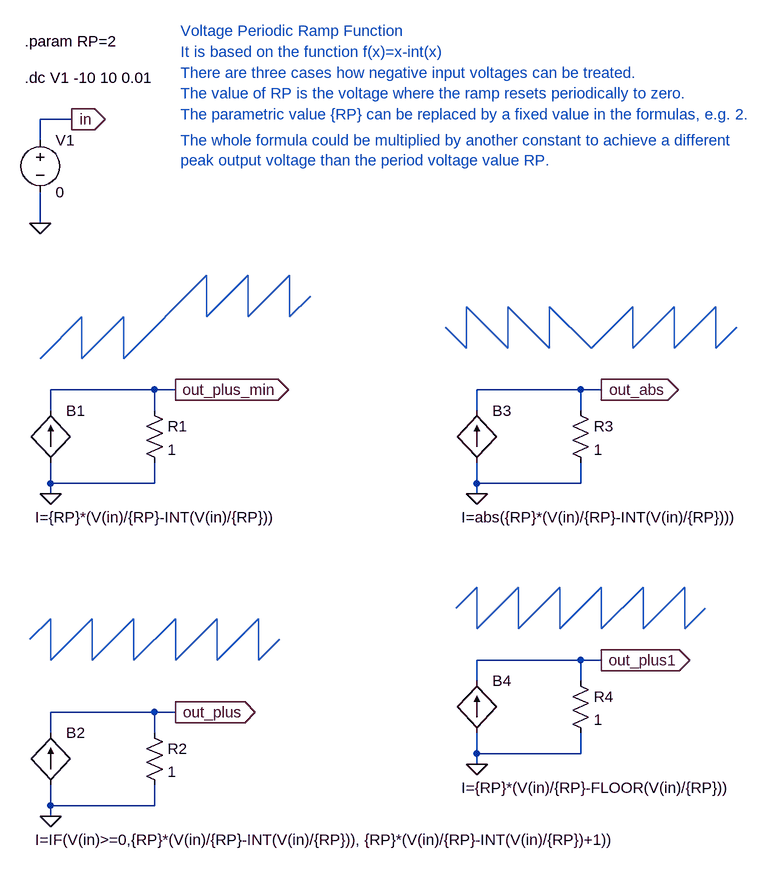
[diagram p0: schematic voltage_periodic_ramp1.asc]
voltage_periodic_ramp1.asc, the LTspice schematic file:
Version 4
SHEET 1 1676 1092
WIRE 16 0 16 -32
WIRE 16 128 16 80
WIRE 32 416 32 384
WIRE 32 528 32 496
WIRE 32 544 32 528
WIRE 32 912 32 880
WIRE 32 1024 32 992
WIRE 32 1040 32 1024
WIRE 64 -32 16 -32
WIRE 192 384 32 384
WIRE 192 416 192 384
WIRE 192 528 32 528
WIRE 192 528 192 496
WIRE 192 880 32 880
WIRE 192 912 192 880
WIRE 192 1024 32 1024
WIRE 192 1024 192 992
WIRE 224 384 192 384
WIRE 224 880 192 880
WIRE 688 416 688 384
WIRE 688 528 688 496
WIRE 688 544 688 528
WIRE 688 832 688 800
WIRE 688 944 688 912
WIRE 688 960 688 944
WIRE 848 384 688 384
WIRE 848 416 848 384
WIRE 848 528 688 528
WIRE 848 528 848 496
WIRE 848 800 688 800
WIRE 848 832 848 800
WIRE 848 944 688 944
WIRE 848 944 848 912
WIRE 880 384 848 384
WIRE 880 800 848 800
FLAG 16 128 0
FLAG 64 -32 in
IOPIN 64 -32 Out
FLAG 32 544 0
FLAG 224 384 out_plus_min
IOPIN 224 384 Out
FLAG 32 1040 0
FLAG 224 880 out_plus
IOPIN 224 880 Out
FLAG 688 544 0
FLAG 880 384 out_abs
IOPIN 880 384 Out
FLAG 688 960 0
FLAG 880 800 out_plus1
IOPIN 880 800 Out
SYMBOL bi2 32 416 R0
WINDOW 3 -24 164 Left 0
SYMATTR Value I={RP}*(V(in)/{RP}-INT(V(in)/{RP}))
SYMATTR InstName B1
SYMBOL res 176 400 R0
SYMATTR InstName R1
SYMATTR Value 1
SYMBOL voltage 16 -16 R0
SYMATTR InstName V1
SYMATTR Value 0
SYMBOL bi2 32 912 R0
WINDOW 3 -24 164 Left 0
SYMATTR Value I=IF(V(in)>=0,{RP}*(V(in)/{RP}-INT(V(in)/{RP})), {RP}*(V(in)/{RP}-INT(V(in)/{RP})+1))
SYMATTR InstName B2
SYMBOL res 176 896 R0
SYMATTR InstName R2
SYMATTR Value 1
SYMBOL bi2 688 416 R0
WINDOW 3 -24 164 Left 0
SYMATTR Value I=abs({RP}*(V(in)/{RP}-INT(V(in)/{RP})))
SYMATTR InstName B3
SYMBOL res 832 400 R0
SYMATTR InstName R3
SYMATTR Value 1
SYMBOL bi2 688 832 R0
WINDOW 3 -24 164 Left 0
SYMATTR Value I={RP}*(V(in)/{RP}-FLOOR(V(in)/{RP}))
SYMATTR InstName B4
SYMBOL res 832 816 R0
SYMATTR InstName R4
SYMATTR Value 1
TEXT -8 -152 Left 0 !.param RP=2
TEXT -8 -96 Left 0 !.dc V1 -10 10 0.01
TEXT 232 -72 Left 0 ;The value of RP is the voltage where the ramp resets periodically to zero.
TEXT 232 -40 Left 0 ;The parametric value {RP} can be replaced by a fixed value in the formulas, e.g. 2.
TEXT 232 -168 Left 0 ;Voltage Periodic Ramp Function
TEXT 232 -136 Left 0 ;It is based on the function f(x)=x-int(x)
TEXT 232 -104 Left 0 ;There are three cases how negative input voltages can be treated.
TEXT 232 0 Left 0 ;The whole formula could be multiplied by another constant to achieve a different\npeak output voltage than the period voltage value RP.
LINE Normal 272 208 144 336
LINE Normal 272 272 272 208
LINE Normal 336 208 272 272
LINE Normal 336 272 336 208
LINE Normal 400 208 336 272
LINE Normal 400 272 400 208
LINE Normal 432 240 400 272
LINE Normal 144 288 144 336
LINE Normal 144 272 144 288
LINE Normal 80 336 144 272
LINE Normal 80 272 80 336
LINE Normal 16 336 80 272
LINE Normal 224 736 160 800
LINE Normal 224 800 224 736
LINE Normal 288 736 224 800
LINE Normal 288 800 288 736
LINE Normal 352 736 288 800
LINE Normal 352 800 352 736
LINE Normal 384 768 352 800
LINE Normal 160 752 160 800
LINE Normal 160 736 160 752
LINE Normal 96 800 160 736
LINE Normal 96 736 96 800
LINE Normal 32 800 96 736
LINE Normal 32 752 32 800
LINE Normal 32 736 32 752
LINE Normal 0 768 32 736
LINE Normal 928 256 864 320
LINE Normal 928 320 928 256
LINE Normal 992 256 928 320
LINE Normal 992 320 992 256
LINE Normal 1056 256 992 320
LINE Normal 1056 320 1056 256
LINE Normal 1088 288 1056 320
LINE Normal 800 256 864 320
LINE Normal 800 256 800 256
LINE Normal 800 320 800 256
LINE Normal 736 256 800 320
LINE Normal 736 320 736 256
LINE Normal 672 256 736 320
LINE Normal 672 256 672 256
LINE Normal 672 320 672 256
LINE Normal 640 288 672 320
LINE Normal 880 688 816 752
LINE Normal 880 752 880 688
LINE Normal 944 688 880 752
LINE Normal 944 752 944 688
LINE Normal 1008 688 944 752
LINE Normal 1008 752 1008 688
LINE Normal 1040 720 1008 752
LINE Normal 816 704 816 752
LINE Normal 816 688 816 704
LINE Normal 752 752 816 688
LINE Normal 752 688 752 752
LINE Normal 688 752 752 688
LINE Normal 688 704 688 752
LINE Normal 688 688 688 704
LINE Normal 656 720 688 688

The netlist it stands for:
* voltage_periodic_ramp1.asc
B1 0 out_plus_min I={RP}*(V(in)/{RP}-INT(V(in)/{RP}))
R1 out_plus_min 0 1
V1 in 0 0
B2 0 out_plus I=IF(V(in)>=0,{RP}*(V(in)/{RP}-INT(V(in)/{RP})), {RP}*(V(in)/{RP}-INT(V(in)/{RP})+1))
R2 out_plus 0 1
B3 0 out_abs I=abs({RP}*(V(in)/{RP}-INT(V(in)/{RP})))
R3 out_abs 0 1
B4 0 out_plus1 I={RP}*(V(in)/{RP}-FLOOR(V(in)/{RP}))
R4 out_plus1 0 1
.param RP=2
.dc V1 -10 10 0.01
* The value of RP is the voltage where the ramp resets periodically to zero.
* The parametric value {RP} can be replaced by a fixed value in the formulas, e.g. 2.
* Voltage Periodic Ramp Function
* It is based on the function f(x)=x-int(x)
* There are three cases how negative input voltages can be treated.
* The whole formula could be multiplied by another constant to achieve a different
* peak output voltage than the period voltage value RP.
.backanno
.end